# EAGLE design fet-switch-smd-16mm-mk-1.0 (EAGLE 9.2.2)
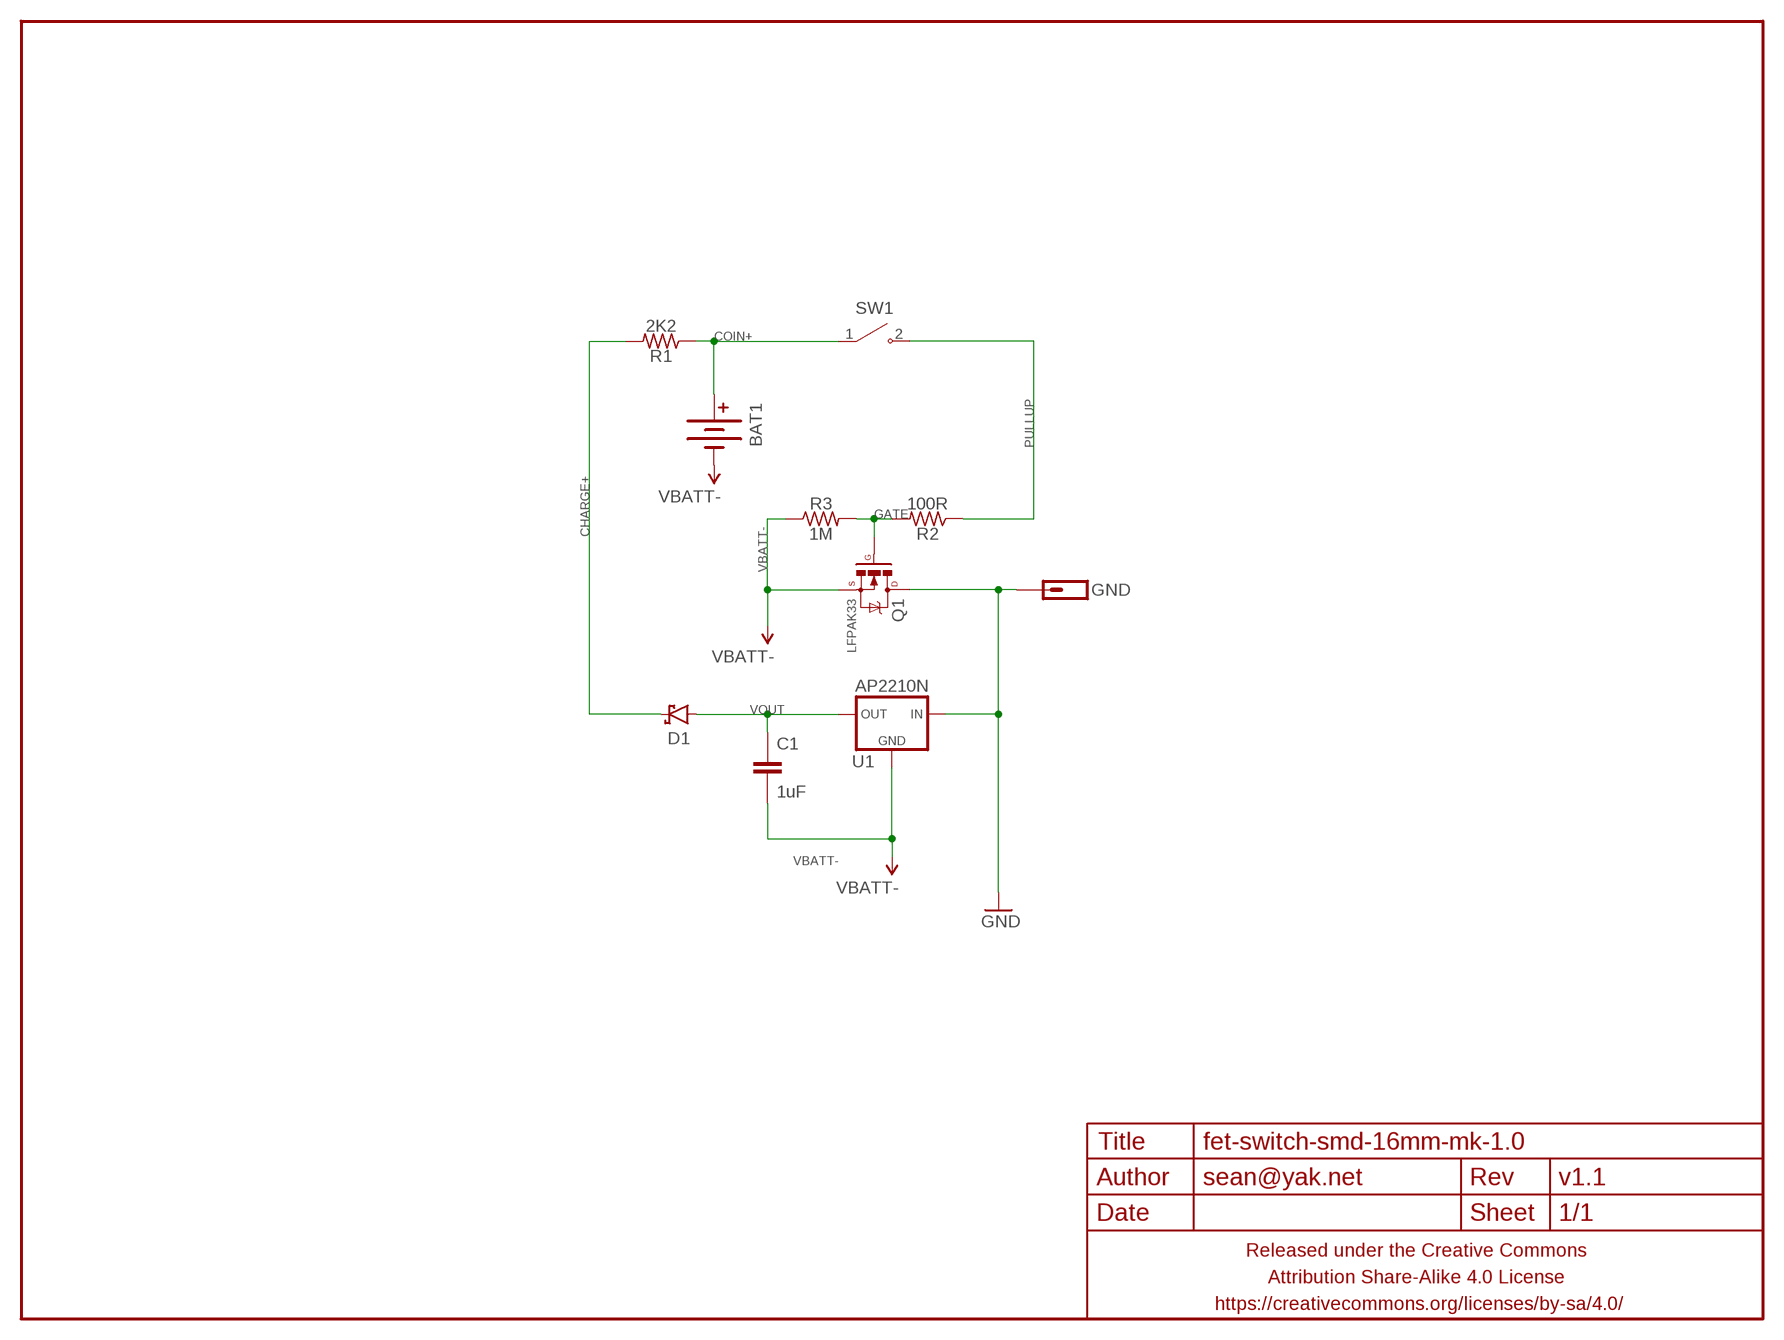
[diagram p0: schematic, sheet 1]

## Parts
BAT1  BATTERYML414  [BATTCON_4.8MM]
C1  1uF  CAPACITOR-CERAMICC0402  [C0402]
D1  DIODE-SCHOTTKYSOD323  [SOD323-SCHOTTKY]
FRAME1  FRAME-LETTERNO_PACKAGE  [DUMMY]
GND  M01NOT-A-VIA-NOPE  [1X01_NOSILK_NOSTOP]
Q1  LFPAK33  MOSFET-NCHANNELLFPAK33  [LFPAK33]
R1  2K2  RESISTORR0402  [R0402]
R2  100R  RESISTORR0402  [R0402]
R3  1M  RESISTORR0402  [R0402]
SW1  SWITCH-SPSTOMTEN-1288-SMD-NS  [OMTEN-1288-LESS2-NS]
U1  AP2210N  V_REG_78XXAP2210N-TIGHTER  [SOT23-TIGHTER]

## Nets
CHARGE+: D1.C R1.2
COIN+: BAT1.A1(+) BAT1.A2(+) R1.1 SW1.1(COM)
GATE: Q1.4(G) R2.2 R3.2
GND: GND.P$1 Q1.PAD(D) U1.3(IN)
PULLUP: R2.1 SW1.2(NO)
VBATT-: BAT1.- C1.2 Q1.1(S) Q1.2(S) Q1.3(S) R3.1 U1.1(GND)
VOUT: C1.1 D1.A U1.2(OUT)

## Library data of the parts
BAT1 = a_parts:BATTERY: Battery Holders Various common sizes : AA, AAA, 20mm coin cell and 12mm coin cell. 20MM_4LEGS, BATT-10373
C1 = a_parts:CAPACITOR-CERAMIC: CAPACITOR, European symbol
D1 = a_parts:DIODE-SCHOTTKY: Schottky diodes in SFE's production catalog BAT20J 1A 23V 0.62Vf RB751 120mA 40V 0.37Vf PMEG4005EJ 0.5A 40V 0.42Vf MBRA140 1A 40V 0.5Vf B340A 3A 40V SMA
FRAME1 = a_parts:FRAME-LETTER: Schematic Frame Standard 8.5x11 US Letter frame; DESIGNER: sean@yak.net; VERSION: v1.1
GND = a_parts:M01: Header 1 Standard 1-pin 0.1" header. Use with straight break away headers (SKU : PRT-00116), right angle break away headers (PRT-00553), swiss pins (PRT-00743), machine pins (PRT-00117), and female headers (PRT-00115).
Q1 = a_parts:MOSFET-NCHANNEL: Common NMOSFET Parts MFG P/N Store ID Prod ID FDD8780 TRANS-09984 SI7820DN TRANS-11055 FDS6630A IC-08089 2N7002PW TRANS-11151 FQP30N06L COM-10213 TRANS-10060 BSS123LT1G TRANS-08345 BSS138 TRANS-00830 BS170 2N7000
R1-R3 = a_parts:RESISTOR: RESISTOR, American symbol
SW1 = a_parts:SWITCH-SPST
U1 = a_parts:V_REG_78XX: Voltage Regulator Standard 7805 5V regulator. IGO (Input Ground Output). Spark Fun Electronics SKU : COM-00107

## Board
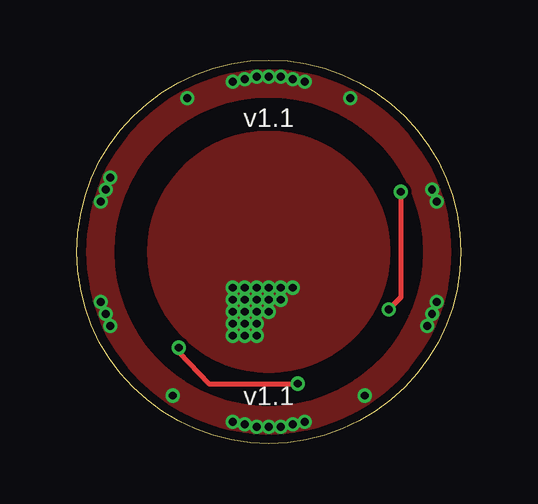
[diagram p1: board, top side]
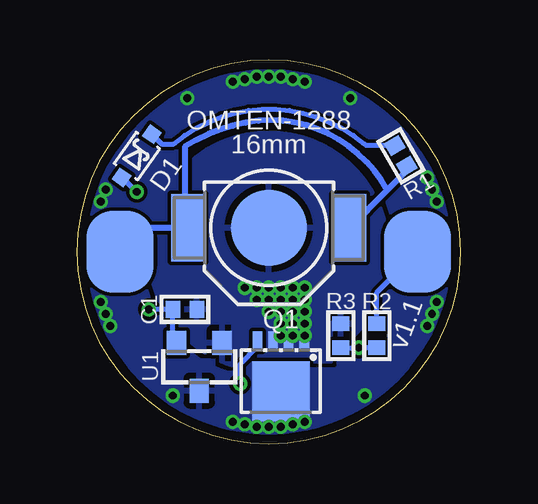
[diagram p2: board, bottom side, seen from below]

Size 16 x 16 mm. Coordinates in mm from the lower left corner, seen from the top.
Outline: 0,8 arc-180 16,8 arc-180 0,8
Copper layers (1*16): Top 0.035559375mm / dielectric 1.6mm / Bottom 0.035559375mm
Design rules "oshpark-2layer": minimum track width 6mil, minimum drill 10mil, track to track 6mil, track to pad 6mil, pad to pad 6mil, via to via 6mil, smd to smd 0mil, copper to edge 15mil, drill to drill 6mil, minimum pad ring 5mil, minimum via ring 5mil, stop-mask expansion 2.5mil, vias tented up to drill 20mil, thermal gap 10mil

### Footprints (pad centres in the part's own frame; a part is rotated, then mirrored left to right if it is on the bottom)
BATTCON_4.8MM = smd 3.18 x 3.18: - 0,0 | smd 1.4 x 2.8: A1 -3.365,0; A2 3.365,0
C0402 = smd 0.6 x 0.7: 1 -0.5,0; 2 0.5,0
SOD323-SCHOTTKY = smd 0.6 x 0.6: A -1.1,0; C 1.1,0
1X01_NOSILK_NOSTOP = drill 0.33: P$1 0,0
LFPAK33 = smd 0.4 x 0.8: 1 -0.975,-1.685; 2 -0.325,-1.685; 3 0.325,-1.685; 4 0.975,-1.685 | smd 2.4 x 2.5: PAD 0,0.415
R0402 = smd 0.6 x 0.7: 1 -0.5,0; 2 0.5,0
OMTEN-1288-LESS2-NS = smd 2.78 x 3.4: 1 -6.2,0; 2 6.2,0
SOT23-TIGHTER = smd 0.8 x 1: 1 -0.95,-1; 2 0.95,-1; 3 0,1

### Placement (x,y rotation side)
BAT1  8,9 0 bottom
C1  11.5,5.6 0 bottom
D1  13.5,12 55 bottom
FRAME1  0,0 0 top
GND  8,15.3 90 bottom
Q1  7.5,2.6 180 bottom
R1  2.5,12 120 bottom
R2  3.5,4.5 270 bottom
R3  5,4.5 270 bottom
SW1  8,8 0 bottom
U1  10.9,3.2 180 bottom

### Tracks (layer width: path | path; a pad name or v marks a point on that pad's centre or on a via)
CHARGE+
  Bottom 0.2: R1.2 3.95,12.43 4.02,12.5 arc-80 11.97,12.5 12.47,12.5 D1.C
COIN+
  Bottom 0.25: R1.1 2.25,11.38 3.07,10.57 | 3.07,10.57 BAT1.A2 | 3.07,10.57 arc-60 7.9,13.5 arc-30 11.48,12.4 11.48,9 | BAT1.A1 11.48,9 | 11.48,9 13.2,9 SW1.1
GATE  (via drill 0.33)
  Top 0.2: v4.25,4 4.25,3.8 5.5,2.5 v9.2,2.5
  Bottom 0.2: v9.2,2.5 9.2,3.3 8.47,4.03 Q1.4 | R2.2 v4.25,4 R3.2
GND  (via drill 0.33)
  other vias: 8,0.7 7.5,0.7 7,0.8 6.5,0.9 8.5,0.7 9,0.8 9.5,0.9 7.5,15.3 8.5,15.3 9,15.2 9.5,15.1 7,15.2 6.5,15.1 1.2,10.6 1.4,11.1 1,5.9 1.2,5.4 1.4,4.9 1,10.1 15,5.9 14.8,5.4 14.6,4.9 15,10.1 14.8,10.6 4.6,14.4 11.4,14.4 4,2 12,2
  pour Top (isolate 0.152, rank 6, no thermals): 16,8 arc90 8,16 arc90 0,8 1.5,8 arc-90 8,14.5 arc-90 14.5,8
  pour Top (isolate 0.152, rank 6, no thermals): 0,8 arc90 8,0 arc90 16,8 14.5,8 arc-90 8,1.5 arc-90 1.5,8
  pour Bottom (rank 6): 0,16 0,0 16,0 16,16
PULLUP
  Bottom 0.2: R2.1 3.5,6.3 SW1.2
VBATT-  (via drill 0.33)
  other vias: 8,6.5 7.5,6.5 8.5,6.5 9,6.5 7,6.5 6.5,6.5 6.5,6 7,6 7.5,6 8,6 8.5,6 8,5.5 7.5,5.5 7,5.5 6.5,5.5 6.5,5 6.5,4.5 7,5 7,4.5 7.5,5 7.5,4.5
  pour Top (isolate 0.152, no thermals): 3,8 arc90 8,3 arc90 13,8 arc90 8,13 arc90
  pour Bottom (rank 5): 3,8 arc-90 8,13 arc-90 13,8 arc-90 8,3 arc-90
  pour Bottom (rank 4, no thermals): 5.4,5 9.5,5 9.5,3.4 5.4,3.4
VOUT  (via drill 0.33)
  Top 0.2: v13.5,10.5 13.5,6.1 v13,5.6
  Bottom 0.2: U1.2 12,4.35 C1.1 v13,5.6 | v13.5,10.5 14.1,11.1 D1.A

### Text on the board
bPlace: 16mm | OMTEN-1288